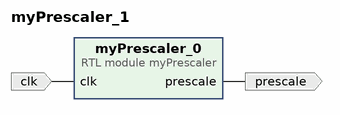
[diagram p0: block diagram of the top level]
# Vivado block design myPrescaler_1, xc7z020clg484-1, Vivado 2017.2
create_bd_design myPrescaler_1

create_bd_port -dir I -type clk clk
create_bd_port -dir O prescale

create_bd_cell -type module -reference myPrescaler myPrescaler_0

# ---- connections ----

connect_bd_net [get_bd_ports clk] [get_bd_pins myPrescaler_0/clk]
connect_bd_net [get_bd_pins myPrescaler_0/prescale] [get_bd_ports prescale]

validate_bd_design
save_bd_design
